# Altium schematic sheet System.SchDoc
size A; SheetNumber: 1; SheetTotal: 4
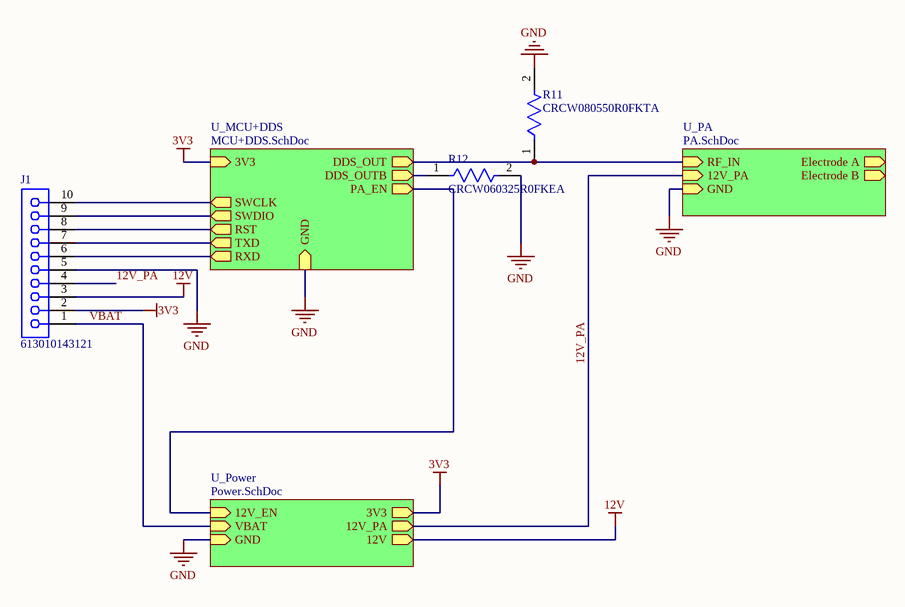
[diagram p0: System.SchDoc]

## Parts
J1  613010143121  [613010143121]
R11  CRCW080550R0FKTA  [FP-D12-CRCW0805-MFG]
R12  CRCW060325R0FKEA  [FP-CRCW0603-e3-IPC_B]

## Sub-sheets
U_MCU+DDS = MCU+DDS.SchDoc: 3V3 (in), GND (in), DDS_OUTB (out), DDS_OUT (out), PA_EN (out), SWCLK (out), SWDIO (out), RST (out), TXD (out), RXD (out)
U_PA = PA.SchDoc: RF_IN (in), Electrode A (out), Electrode B (out), 12V_PA (in), GND (in)
U_Power = Power.SchDoc: 12V_EN (in), VBAT (in), 3V3 (out), 12V_PA (out), GND (in), 12V (out)

## Nets
3V3: J1.2 ; sheet U_MCU+DDS/3V3, sheet U_Power/3V3
12V: J1.3 ; sheet U_Power/12V
GND: J1.5 R11.2 R12.2 ; sheet U_PA/GND, sheet U_MCU+DDS/GND, sheet U_Power/GND
12V_PA: J1.4 ; sheet U_PA/12V_PA, sheet U_Power/12V_PA
VBAT: J1.1 ; sheet U_Power/VBAT
NetJ1_6: J1.6 ; sheet U_MCU+DDS/RXD
NetJ1_7: J1.7 ; sheet U_MCU+DDS/TXD
NetJ1_8: J1.8 ; sheet U_MCU+DDS/RST
NetJ1_9: J1.9 ; sheet U_MCU+DDS/SWDIO
NetJ1_10: J1.10 ; sheet U_MCU+DDS/SWCLK
NetR11_1: R11.1 ; sheet U_PA/RF_IN, sheet U_MCU+DDS/DDS_OUT
NetR12_1: R12.1 ; sheet U_MCU+DDS/DDS_OUTB
(unnamed): sheet U_MCU+DDS/PA_EN, sheet U_Power/12V_EN

## Library data of the parts
J1 = CMP-1502-01419-3: NexarPartId: 18818161; Operating Supply Voltage: 250V; Contact Resistance: 20mΩ; Gender: Female; Insulation Resistance: 1GΩ; Connector Type: Header, Socket; Insulation: Insulated; Current Rating: 3A; Number of Positions: 10; Pitch: 2.54mm; Number of Rows: 1; Number of Pins: 10; Voltage Rating: 250V; Length: 25.9mm; Contact Gender: Female; RoHS: Compliant; Contact Plating: Gold; Height: 8.5mm; Min Operating Temperature: -40°C; Contact Material: Copper; Number of Contacts: 10; REACH SVHC: Unknown; Mount: Through Hole; Lead Pitch: 2.54mm; Width: 25.9mm; Max Operating Temperature: 125°C; Flammability Rating: UL94 V-0; Termination: Through Hole; Color: Black; Housing Material: PBT
R11 = CMP-00030-21390498-1: CRCW080550R0FKTA Res Thick Film 0805 50 Ohm 1% 0.125W(1/8W) ±100ppm/C Pad SMD Automotive T/R; Temperature Coefficient: 100ppm/°C; Resistance: 50Ω; Voltage Rating: 150V; Power Rating: 125mW; Length: 2mm; Case Code (Imperial): 0805; Height: 450µm; Contact Plating: Lead, Tin; Width: 1.25mm; Max Operating Temperature: 155°C; NexarPartId: 21390498; Case Code (Metric): 2012; Min Operating Temperature: -55°C; Tolerance: 1%; Case/Package: 0805; Lead Free: Contains Lead; RoHS: Non-Compliant; Composition: Thick Film; Weight: 5.499807mg
R12 = CMP-02407-008643-1: RES Thick Film, 25Ω, 1%, 0.1W, 100ppm/°C, 0603; Resistance: 25R; Power Rating: 100mW; Case/Package: 0603; Lead Free: Lead Free; Tolerance: 1%